# Altium schematic sheet Camera_schematics.SchDoc: TeensyCam - Stereo Camera Module
size A3; Address2: BoredomProjects.net; Revision: 1; SheetNumber: 1; SheetTotal: 1; DocumentName: TeensyCam; ProjectName: TeensyCam
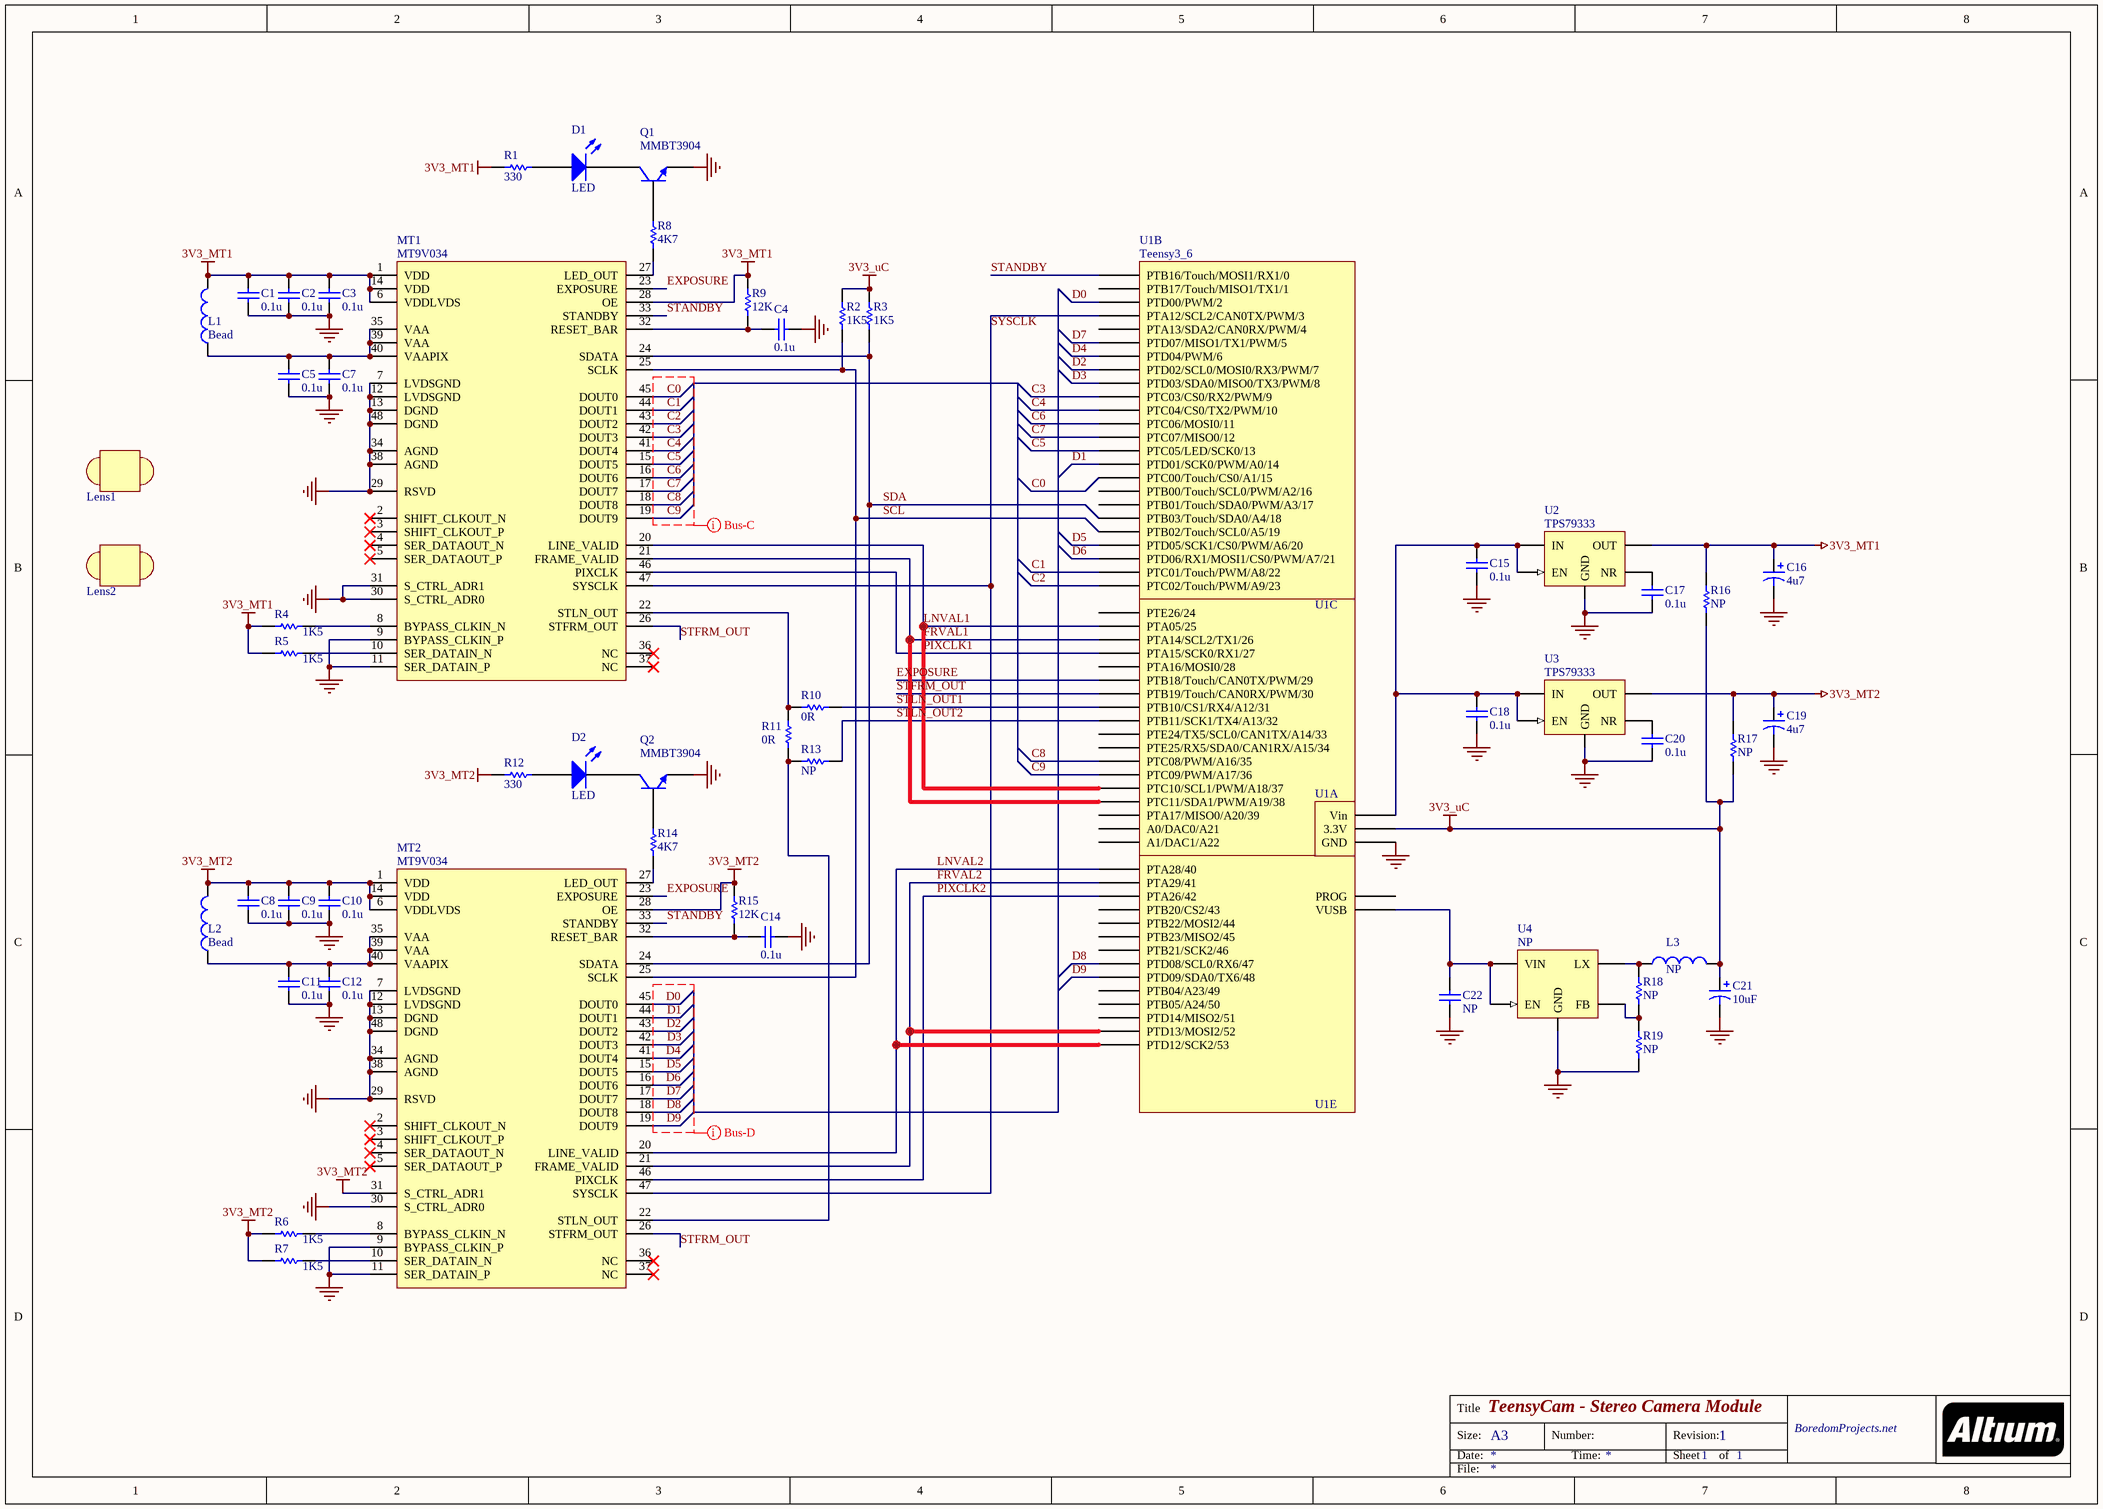
[diagram p0: Camera_schematics.SchDoc]

## Parts
C1  0.1u  [1608[0603]]
C2  0.1u  [1608[0603]]
C3  0.1u  [1608[0603]]
C4  0.1u  [1608[0603]]
C5  0.1u  [1608[0603]]
C7  0.1u  [1608[0603]]
C8  0.1u  [1608[0603]]
C9  0.1u  [1608[0603]]
C10  0.1u  [1608[0603]]
C11  0.1u  [1608[0603]]
C12  0.1u  [1608[0603]]
C14  0.1u  [1608[0603]]
C15  0.1u  [1608[0603]]
C16  4u7  [C1206]
C17  0.1u  [1608[0603]]
C18  0.1u  [1608[0603]]
C19  4u7  [C1206]
C20  0.1u  [1608[0603]]
C21  10uF  [C1206]
C22  NP  [1608[0603]]
D1  LED  [3.2X1.6X1.1]
D2  LED  [3.2X1.6X1.1]
L1  Bead  [INDC1608L]
L2  Bead  [INDC1608L]
L3  NP  [INDC3216]
Lens1  CCD  [CCD_LENS_20MM]  (value not drawn)
Lens2  CCD  [CCD_LENS_20MM]  (value not drawn)
MT1  MT9V034  [CLCC_48]
MT2  MT9V034  [CLCC_48]
Q1  MMBT3904  [SOT23_N]
Q2  MMBT3904  [SOT23_N]
R1  330  [J1-0603]
R2  1K5  [J1-0603]
R3  1K5  [J1-0603]
R4  1K5  [J1-0603]
R5  1K5  [J1-0603]
R6  1K5  [J1-0603]
R7  1K5  [J1-0603]
R8  4K7  [J1-0603]
R9  12K  [J1-0603]
R10  0R  [0402]
R11  0R  [0402]
R12  330  [J1-0603]
R13  NP  [0402]
R14  4K7  [J1-0603]
R15  12K  [J1-0603]
R16  NP  [J1-0603]
R17  NP  [J1-0603]
R18  NP  [0402]
R19  NP  [0402]
U1  Teensy3_6  [Teensy3.6-most-pins]  (value not drawn)  (parts A,B,C,E of 5)
U2  TPS79333  [SOT23-5_L]
U3  TPS79333  [SOT23-5_L]
U4  NP  [SOT23-5_L]

## Nets
3V3_MT1: C1.2 C2.2 C3.2 C16.1 L1.2 MT1.1(VDD) MT1.6(VDDLVDS) MT1.14(VDD) MT1.28(OE) R1.2 R4.1 R5.1 R9.2 R16.1 U2.5(OUT)
3V3_MT2: C8.2 C9.2 C10.2 C19.1 L2.2 MT2.1(VDD) MT2.6(VDDLVDS) MT2.14(VDD) MT2.28(OE) MT2.31(S_CTRL_ADR1) R6.1 R7.1 R12.2 R15.2 R17.1 U3.5(OUT)
3V3_uC: C21.1 L3.2 R2.2 R3.2 R16.2 R17.2 U1.3V3(3.3V)
GND: C1.1 C2.1 C3.1 C4.2 C5.1 C7.1 C8.1 C9.1 C10.1 C11.1 C12.1 C14.2 C15.1 C16.2 C17.1 C18.1 C19.2 C20.1 C21.2 C22.1 Lens1.0 Lens2.0 MT1.7(LVDSGND) MT1.9(BYPASS_CLKIN_P) MT1.11(SER_DATAIN_P) MT1.12(LVDSGND) MT1.13(DGND) MT1.29(RSVD) MT1.30(S_CTRL_ADR0) MT1.31(S_CTRL_ADR1) MT1.34(AGND) MT1.38(AGND) MT1.48(DGND) MT2.7(LVDSGND) MT2.9(BYPASS_CLKIN_P) MT2.11(SER_DATAIN_P) MT2.12(LVDSGND) MT2.13(DGND) MT2.29(RSVD) MT2.30(S_CTRL_ADR0) MT2.34(AGND) MT2.38(AGND) MT2.48(DGND) Q1.2(E) Q2.2(E) R19.1 U1.GND U2.2(GND) U3.2(GND) U4.2(GND)
C0: MT1.45(DOUT0) U1.15(PTC00/Touch/CS0/A1/15)
C1: MT1.44(DOUT1) U1.22(PTC01/Touch/PWM/A8/22)
C2: MT1.43(DOUT2) U1.23(PTC02/Touch/PWM/A9/23)
C3: MT1.42(DOUT3) U1.9(PTC03/CS0/RX2/PWM/9)
C4: MT1.41(DOUT4) U1.10(PTC04/CS0/TX2/PWM/10)
C5: MT1.15(DOUT5) U1.13(PTC05/LED/SCK0/13)
C6: MT1.16(DOUT6) U1.11(PTC06/MOSI0/11)
C7: MT1.17(DOUT7) U1.12(PTC07/MISO0/12)
C8: MT1.18(DOUT8) U1.35(PTC08/PWM/A16/35)
C9: MT1.19(DOUT9) U1.36(PTC09/PWM/A17/36)
D0: MT2.45(DOUT0) U1.2(PTD00/PWM/2)
D1: MT2.44(DOUT1) U1.14(PTD01/SCK0/PWM/A0/14)
D2: MT2.43(DOUT2) U1.7(PTD02/SCL0/MOSI0/RX3/PWM/7)
D3: MT2.42(DOUT3) U1.8(PTD03/SDA0/MISO0/TX3/PWM/8)
D4: MT2.41(DOUT4) U1.6(PTD04/PWM/6)
D5: MT2.15(DOUT5) U1.20(PTD05/SCK1/CS0/PWM/A6/20)
D6: MT2.16(DOUT6) U1.21(PTD06/RX1/MOSI1/CS0/PWM/A7/21)
D7: MT2.17(DOUT7) U1.5(PTD07/MISO1/TX1/PWM/5)
D8: MT2.18(DOUT8) U1.47(PTD08/SCL0/RX6/47)
D9: MT2.19(DOUT9) U1.48(PTD09/SDA0/TX6/48)
EXPOSURE: MT1.23(EXPOSURE) MT2.23(EXPOSURE) U1.29(PTB18/Touch/CAN0TX/PWM/29)
FRVAL1: MT1.21(FRAME_VALID) U1.26(PTA14/SCL2/TX1/26)
FRVAL2: MT2.21(FRAME_VALID) U1.41(PTA29/41)
LNVAL1: MT1.20(LINE_VALID) U1.25(PTA05/25)
LNVAL2: MT2.20(LINE_VALID) U1.40(PTA28/40)
PIXCLK1: MT1.46(PIXCLK) U1.27(PTA15/SCK0/RX1/27)
PIXCLK2: MT2.46(PIXCLK) U1.42(PTA26/42)
SCL: MT1.25(SCLK) MT2.25(SCLK) R2.1 U1.19(PTB02/Touch/SCL0/A5/19)
SDA: MT1.24(SDATA) MT2.24(SDATA) R3.1 U1.18(PTB03/Touch/SDA0/A4/18)
STANDBY: MT1.33(STANDBY) MT2.33(STANDBY) U1.0(PTB16/Touch/MOSI1/RX1/0)
STFRM_OUT: MT1.26(STFRM_OUT) MT2.26(STFRM_OUT) U1.30(PTB19/Touch/CAN0RX/PWM/30)
STLN_OUT1: R10.2 U1.31(PTB10/CS1/RX4/A12/31)
STLN_OUT2: R13.2 U1.32(PTB11/SCK1/TX4/A13/32)
SYSCLK: MT1.47(SYSCLK) MT2.47(SYSCLK) U1.3(PTA12/SCL2/CAN0TX/PWM/3)
NetC4_1: C4.1 MT1.32(RESET_BAR) R9.1
NetC5_2: C5.2 C7.2 L1.1 MT1.35(VAA) MT1.39(VAA) MT1.40(VAAPIX)
NetC11_2: C11.2 C12.2 L2.1 MT2.35(VAA) MT2.39(VAA) MT2.40(VAAPIX)
NetC14_1: C14.1 MT2.32(RESET_BAR) R15.1
NetC15_2: C15.2 C18.2 U1.VIN(Vin) U2.1(IN) U2.3(EN) U3.1(IN) U3.3(EN)
NetC17_2: C17.2 U2.4(NR)
NetC20_2: C20.2 U3.4(NR)
NetC22_2: C22.2 U1.VUSB U4.1(EN) U4.4(VIN)
NetD1_1: D1.1(A) R1.1
NetD1_2: D1.2(K) Q1.1(C)
NetD2_1: D2.1(A) R12.1
NetD2_2: D2.2(K) Q2.1(C)
NetL3_1: L3.1 R18.2 U4.3(LX)
NetMT1_8: MT1.8(BYPASS_CLKIN_N) R4.2
NetMT1_10: MT1.10(SER_DATAIN_N) R5.2
NetMT1_22: MT1.22(STLN_OUT) R10.1 R11.2
NetMT1_27: MT1.27(LED_OUT) R8.1
NetMT2_8: MT2.8(BYPASS_CLKIN_N) R6.2
NetMT2_10: MT2.10(SER_DATAIN_N) R7.2
NetMT2_22: MT2.22(STLN_OUT) R11.1 R13.1
NetMT2_27: MT2.27(LED_OUT) R14.1
NetQ1_3: Q1.3(B) R8.2
NetQ2_3: Q2.3(B) R14.2
NetR18_1: R18.1 R19.2 U4.5(FB)

Not connected (* = marked no-connect by the designer): MT1 2(SHIFT_CLKOUT_N)* 3(SHIFT_CLKOUT_P)* 4(SER_DATAOUT_N)* 5(SER_DATAOUT_P)* 36(NC)* 37(NC)*; MT2 2(SHIFT_CLKOUT_N)* 3(SHIFT_CLKOUT_P)* 4(SER_DATAOUT_N)* 5(SER_DATAOUT_P)* 36(NC)* 37(NC)*; U1 1(PTB17/Touch/MISO1/TX1/1) 4(PTA13/SDA2/CAN0RX/PWM/4) 16(PTB00/Touch/SCL0/PWM/A2/16) 17(PTB01/Touch/SDA0/PWM/A3/17) 24(PTE26/24) 28(PTA16/MOSI0/28) 33(PTE24/TX5/SCL0/CAN1TX/A14/33) 34(PTE25/RX5/SDA0/CAN1RX/A15/34) 37(PTC10/SCL1/PWM/A18/37) 38(PTC11/SDA1/PWM/A19/38) 39(PTA17/MISO0/A20/39) 43(PTB20/CS2/43) 44(PTB22/MOSI2/44) 45(PTB23/MISO2/45) 46(PTB21/SCK2/46) 49(PTB04/A23/49) 50(PTB05/A24/50) 51(PTD14/MISO2/51) 52(PTD13/MOSI2/52) 53(PTD12/SCK2/53) A21(A0/DAC0/A21) A22(A1/DAC1/A22) PROG

## Layout directives
net class Bus-D: D0, D1, D2, D3, D4, D5, D6, D7, D8, D9
net class Bus-C: C0, C1, C2, C3, C4, C5, C6, C7, C8, C9

## Notes on the sheet
- Title
- Size:
- Date:
- A3
- Number:
- Time:
- Revision:
- Sheet
- of
- File:

## Library data of the parts
C1-C5 C7-C12 C14 C15 C17 C18 C20 = Cap Semi: Capacitor (Semiconductor SIM Model); Published: 8-Jun-2000; LatestRevisionDate: 29-May-2009; LatestRevisionNote: IPC-7351 Footprint Added.; PackageReference: C1206; Publisher: Altium Limited; PackageDescription: Chip Capacitor; Value: 0.1u
C16 C19 = Cap Pol3: Polarized Capacitor (Surface Mount); Value: 10uF; Published: 8-Jun-2000; LatestRevisionDate: 29-May-2009; LatestRevisionNote: IPC-7351 Footprint Added.; PackageReference: C0805; Publisher: Altium Limited; PackageDescription: Chip Capacitor
C21 = Cap Pol3: Polarized Capacitor (Surface Mount); Published: 8-Jun-2000; LatestRevisionDate: 29-May-2009; LatestRevisionNote: IPC-7351 Footprint Added.; PackageReference: C0805; Publisher: Altium Limited; PackageDescription: Chip Capacitor; Value: 10uF
C22 = Cap Semi: Capacitor (Semiconductor SIM Model); Value: 1uF; Published: 8-Jun-2000; LatestRevisionDate: 29-May-2009; LatestRevisionNote: IPC-7351 Footprint Added.; PackageReference: C1206; Publisher: Altium Limited; PackageDescription: Chip Capacitor
D1 D2 = LED2: Typical RED, GREEN, YELLOW, AMBER GaAs LED; Published: 8-Jun-2000; LatestRevisionDate: 17-Jul-2002; LatestRevisionNote: Re-released for DXP Platform.; PackageVersion: Feb-2002; PackageReference: 3.2X1.6X1.1; Publisher: Altium Limited; PackageDescription: SM LED; 2 Flat Leads
L1 L2 = Inductor: PartNumber: KMZ1608BHR601CTDH5; Code_IEC: 1005; Published: 8-Jun-2000; LatestRevisionDate: 29-May-2009; LatestRevisionNote: IPC-7351 Footprint Added.; PackageReference: 0402-A; Publisher: Altium Limited; PackageDescription: Chip Inductor; Code_JEITA: 0402; Value: Bead
L3 = Inductor: Code_IEC: 1005; Value: 2.2uH; Published: 8-Jun-2000; LatestRevisionDate: 29-May-2009; LatestRevisionNote: IPC-7351 Footprint Added.; PackageReference: 0402-A; Publisher: Altium Limited; PackageDescription: Chip Inductor; Code_JEITA: 0402
Lens1 Lens2 = lensCCD_20
MT1 MT2 = MT9V034: CMOS; PartNumber: MT9V034C12STM-DP1
Q1 Q2 = NPN: NPN Bipolar Transistor; Published: 8-Jun-2000; LatestRevisionDate: 29-May-2009; LatestRevisionNote: IPC-7351 Footprint Added.; PackageVersion: Aug-1999; PackageReference: SOT-23B; Publisher: Altium Limited; PackageDescription: 3-Pin SOT-23 Package 0.95 mm Pitch, 2.4 mm Lead Span
R1-R9 R12 R14 R15 = Res1: Resistor; Published: 8-Jun-2000; LatestRevisionDate: 17-Jul-2002; LatestRevisionNote: Re-released for DXP Platform.; PackageReference: AXIAL-0.3; Publisher: Altium Limited; PackageDescription: Axial Device, Thru-Hole; 2 Leads; 0.3 in Pin Spacing
  R1 R12: Value: 330
  R2-R7: Value: 1K5
  R8 R14: Value: 4K7
  R9 R15: Value: 12K
R10 R11 R13 = Res1: Resistor; Value: 1K; Published: 8-Jun-2000; LatestRevisionDate: 17-Jul-2002; LatestRevisionNote: Re-released for DXP Platform.; PackageReference: AXIAL-0.3; Publisher: Altium Limited; PackageDescription: Axial Device, Thru-Hole; 2 Leads; 0.3 in Pin Spacing
R16 R17 = Res1: Resistor; Value: Bead; Published: 8-Jun-2000; LatestRevisionDate: 17-Jul-2002; LatestRevisionNote: Re-released for DXP Platform.; PackageReference: AXIAL-0.3; Publisher: Altium Limited; PackageDescription: Axial Device, Thru-Hole; 2 Leads; 0.3 in Pin Spacing
R18 = Res1: Resistor; Value: 450K; Published: 8-Jun-2000; LatestRevisionDate: 17-Jul-2002; LatestRevisionNote: Re-released for DXP Platform.; PackageReference: AXIAL-0.3; Publisher: Altium Limited; PackageDescription: Axial Device, Thru-Hole; 2 Leads; 0.3 in Pin Spacing
R19 = Res1: Resistor; Value: 100K; Published: 8-Jun-2000; LatestRevisionDate: 17-Jul-2002; LatestRevisionNote: Re-released for DXP Platform.; PackageReference: AXIAL-0.3; Publisher: Altium Limited; PackageDescription: Axial Device, Thru-Hole; 2 Leads; 0.3 in Pin Spacing
U2 U3 = TPS79333: 200-mA Low-Dropout Linear Regulator; PartNumber: TPS79333DBVR; Value: TPS79333
U4 = AP3417C: 1.5MHz SYNCHRONOUS STEP-DOWN DC-DC CONVERTER; Value: AP3417C